# EAGLE schematic Arduino_kuukulgur-alternatiivne2 (EAGLE 6.3)

## Sheet 1 of 8
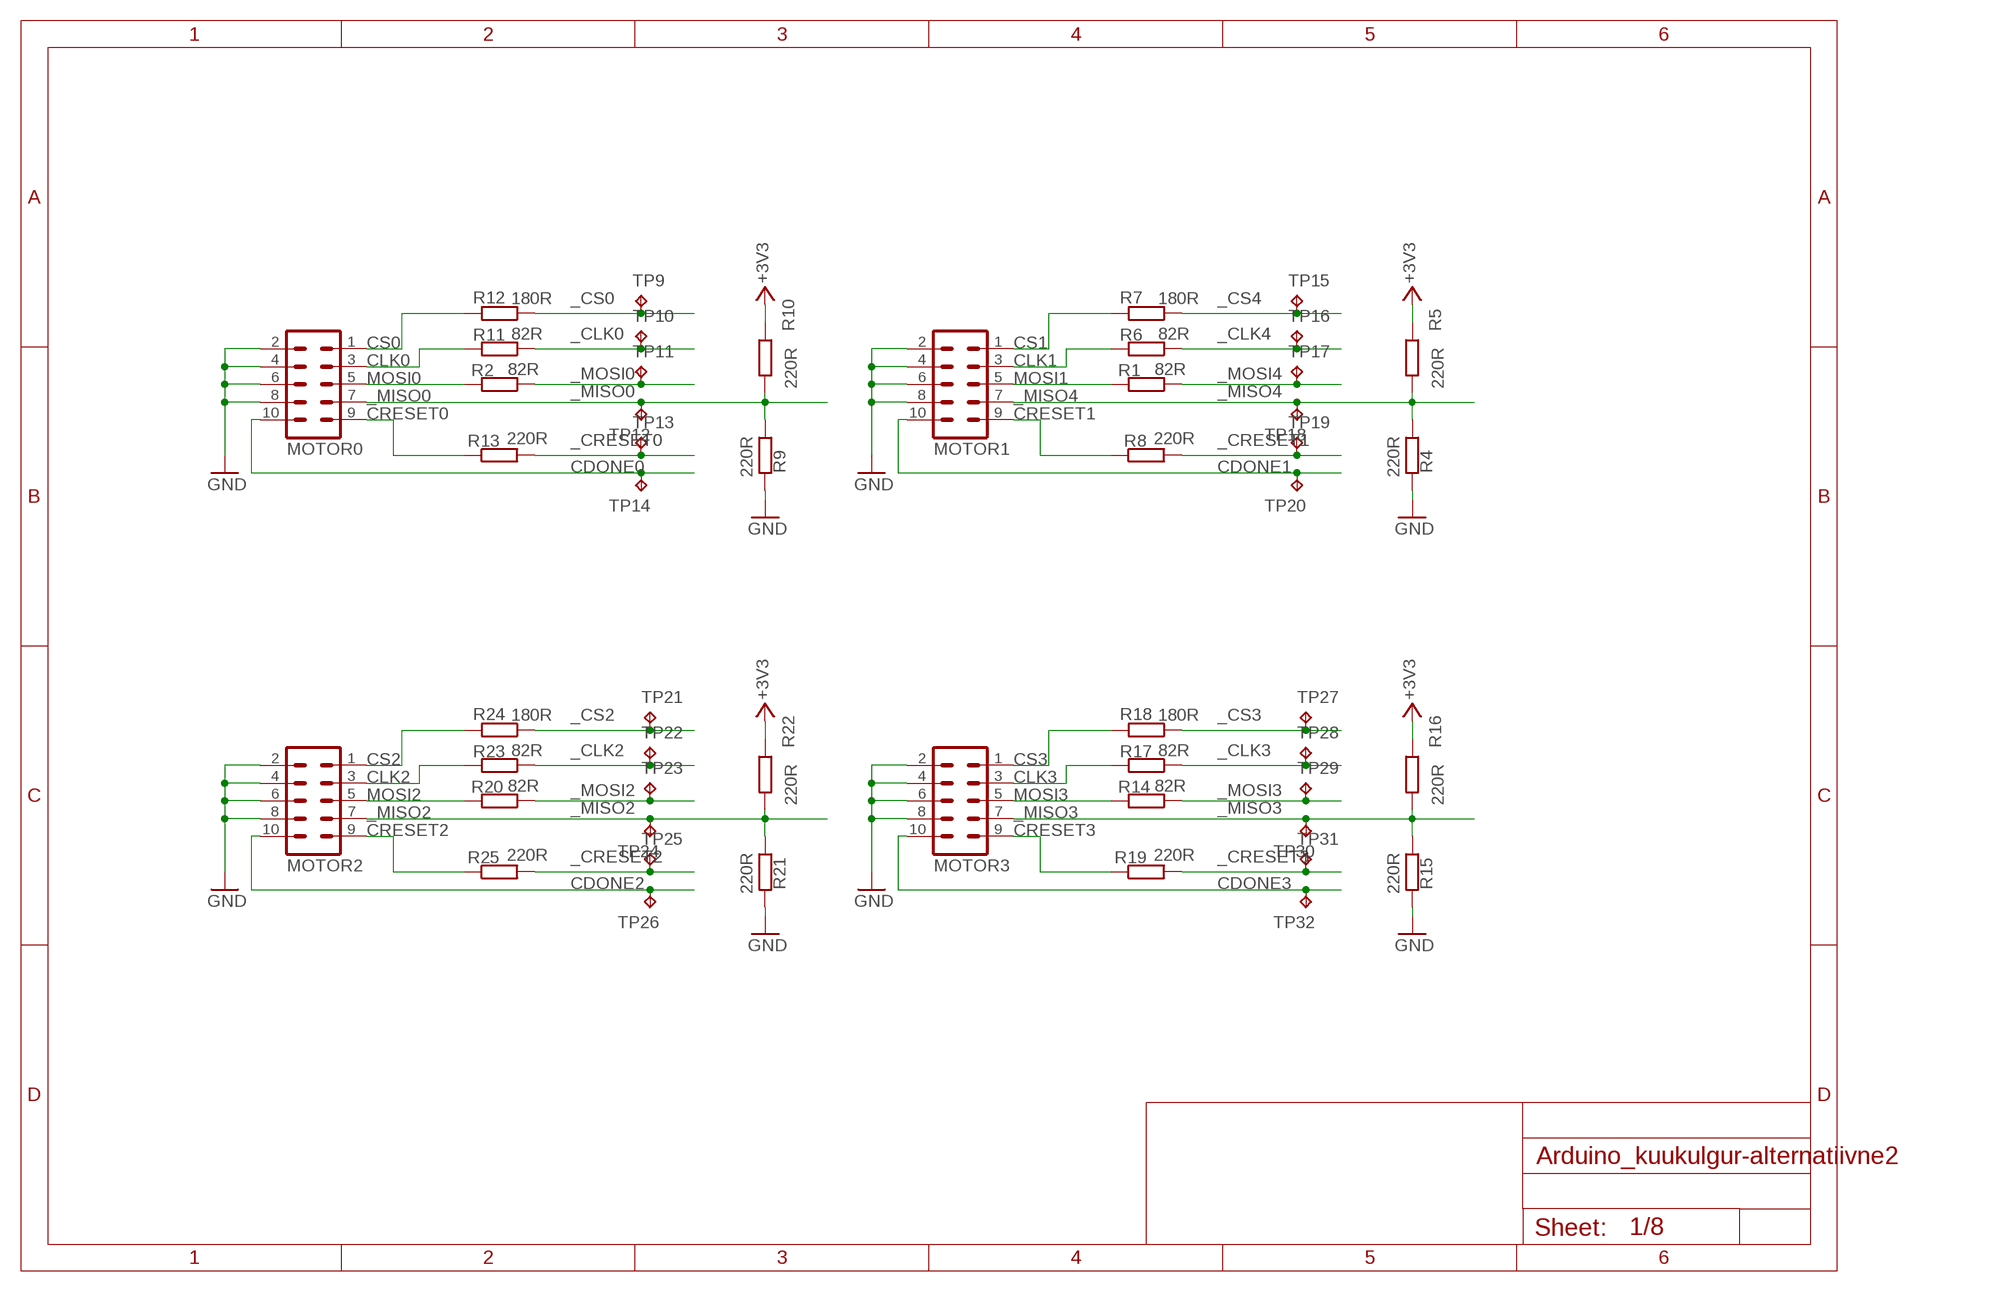
[diagram p0: schematic, sheet 1]

### Parts
MOTOR0  MA05-2  [MA05-2]
MOTOR1  MA05-2  [MA05-2]
MOTOR2  MA05-2  [MA05-2]
MOTOR3  MA05-2  [MA05-2]
R1  82R  R-EU_R0603  [R0603-ROUND]
R2  82R  R-EU_R0603  [R0603-ROUND]
R4  220R  R-EU_R0603  [R0603-ROUND]
R5  220R  R-EU_R0603  [R0603-ROUND]
R6  82R  R-EU_R0603  [R0603-ROUND]
R7  180R  R-EU_R0603  [R0603-ROUND]
R8  220R  R-EU_R0603  [R0603-ROUND]
R9  220R  R-EU_R0603  [R0603-ROUND]
R10  220R  R-EU_R0603  [R0603-ROUND]
R11  82R  R-EU_R0603  [R0603-ROUND]
R12  180R  R-EU_R0603  [R0603-ROUND]
R13  220R  R-EU_R0603  [R0603-ROUND]
R14  82R  R-EU_R0603  [R0603-ROUND]
R15  220R  R-EU_R0603  [R0603-ROUND]
R16  220R  R-EU_R0603  [R0603-ROUND]
R17  82R  R-EU_R0603  [R0603-ROUND]
R18  180R  R-EU_R0603  [R0603-ROUND]
R19  220R  R-EU_R0603  [R0603-ROUND]
R20  82R  R-EU_R0603  [R0603-ROUND]
R21  220R  R-EU_R0603  [R0603-ROUND]
R22  220R  R-EU_R0603  [R0603-ROUND]
R23  82R  R-EU_R0603  [R0603-ROUND]
R24  180R  R-EU_R0603  [R0603-ROUND]
R25  220R  R-EU_R0603  [R0603-ROUND]
TP9  TPB1,27  [B1,27]
TP10  TPB1,27  [B1,27]
TP11  TPB1,27  [B1,27]
TP12  TPB1,27  [B1,27]
TP13  TPB1,27  [B1,27]
TP14  TPB1,27  [B1,27]
TP15  TPB1,27  [B1,27]
TP16  TPB1,27  [B1,27]
TP17  TPB1,27  [B1,27]
TP18  TPB1,27  [B1,27]
TP19  TPB1,27  [B1,27]
TP20  TPB1,27  [B1,27]
TP21  TPB1,27  [B1,27]
TP22  TPB1,27  [B1,27]
TP23  TPB1,27  [B1,27]
TP24  TPB1,27  [B1,27]
TP25  TPB1,27  [B1,27]
TP26  TPB1,27  [B1,27]
TP27  TPB1,27  [B1,27]
TP28  TPB1,27  [B1,27]
TP29  TPB1,27  [B1,27]
TP30  TPB1,27  [B1,27]
TP31  TPB1,27  [B1,27]
TP32  TPB1,27  [B1,27]

### Nets
+4V5 [power]: R5.1 R10.1 R16.1 R22.1 ; supply symbol labelled +3V3 ; also sheet 2,3,4,7,8
_CLK0: R11.1 TP10.TP ; also sheet 2
_CLK2: R23.1 TP22.TP ; also sheet 2
_CLK3: R17.1 TP28.TP ; also sheet 2
_CLK4: R6.1 TP16.TP ; also sheet 2
_CRESET0: R13.2 TP13.TP ; also sheet 2
_CRESET1: R8.2 TP19.TP ; also sheet 2
_CRESET2: R25.2 TP25.TP ; also sheet 2
_CRESET3: R19.2 TP31.TP ; also sheet 2
_CS0: R12.1 TP9.TP ; also sheet 2
_CS2: R24.1 TP21.TP ; also sheet 2
_CS3: R18.1 TP27.TP ; also sheet 2,8
_CS4: R7.1 TP15.TP ; also sheet 2
_MISO0: MOTOR0.7 R9.1 R10.2 TP12.TP ; also sheet 2
_MISO2: MOTOR2.7 R21.1 R22.2 TP24.TP ; also sheet 2
_MISO3: MOTOR3.7 R15.1 R16.2 TP30.TP ; also sheet 2
_MISO4: MOTOR1.7 R4.1 R5.2 TP18.TP ; also sheet 2
_MOSI0: R2.1 TP11.TP ; also sheet 2
_MOSI2: R20.1 TP23.TP ; also sheet 2
_MOSI3: R14.1 TP29.TP ; also sheet 2
_MOSI4: R1.1 TP17.TP ; also sheet 2
CDONE0: MOTOR0.10 TP14.TP ; also sheet 2
CDONE1: MOTOR1.10 TP20.TP ; also sheet 2
CDONE2: MOTOR2.10 TP26.TP ; also sheet 2
CDONE3: MOTOR3.10 TP32.TP ; also sheet 2
CLK0: MOTOR0.3 R11.2
CLK1: MOTOR1.3 R6.2
CLK2: MOTOR2.3 R23.2
CLK3: MOTOR3.3 R17.2
CRESET0: MOTOR0.9 R13.1
CRESET1: MOTOR1.9 R8.1
CRESET2: MOTOR2.9 R25.1
CRESET3: MOTOR3.9 R19.1
CS0: MOTOR0.1 R12.2
CS1: MOTOR1.1 R7.2
CS2: MOTOR2.1 R24.2
CS3: MOTOR3.1 R18.2
GND [morepower]: MOTOR0.2 MOTOR0.4 MOTOR0.6 MOTOR0.8 MOTOR1.2 MOTOR1.4 MOTOR1.6 MOTOR1.8 MOTOR2.2 MOTOR2.4 MOTOR2.6 MOTOR2.8 MOTOR3.2 MOTOR3.4 MOTOR3.6 MOTOR3.8 R4.2 R9.2 R15.2 R21.2 ; also sheet 2,3,4,5,6,7,8
MOSI0: MOTOR0.5 R2.2
MOSI1: MOTOR1.5 R1.2
MOSI2: MOTOR2.5 R20.2
MOSI3: MOTOR3.5 R14.2

## Sheet 2 of 8
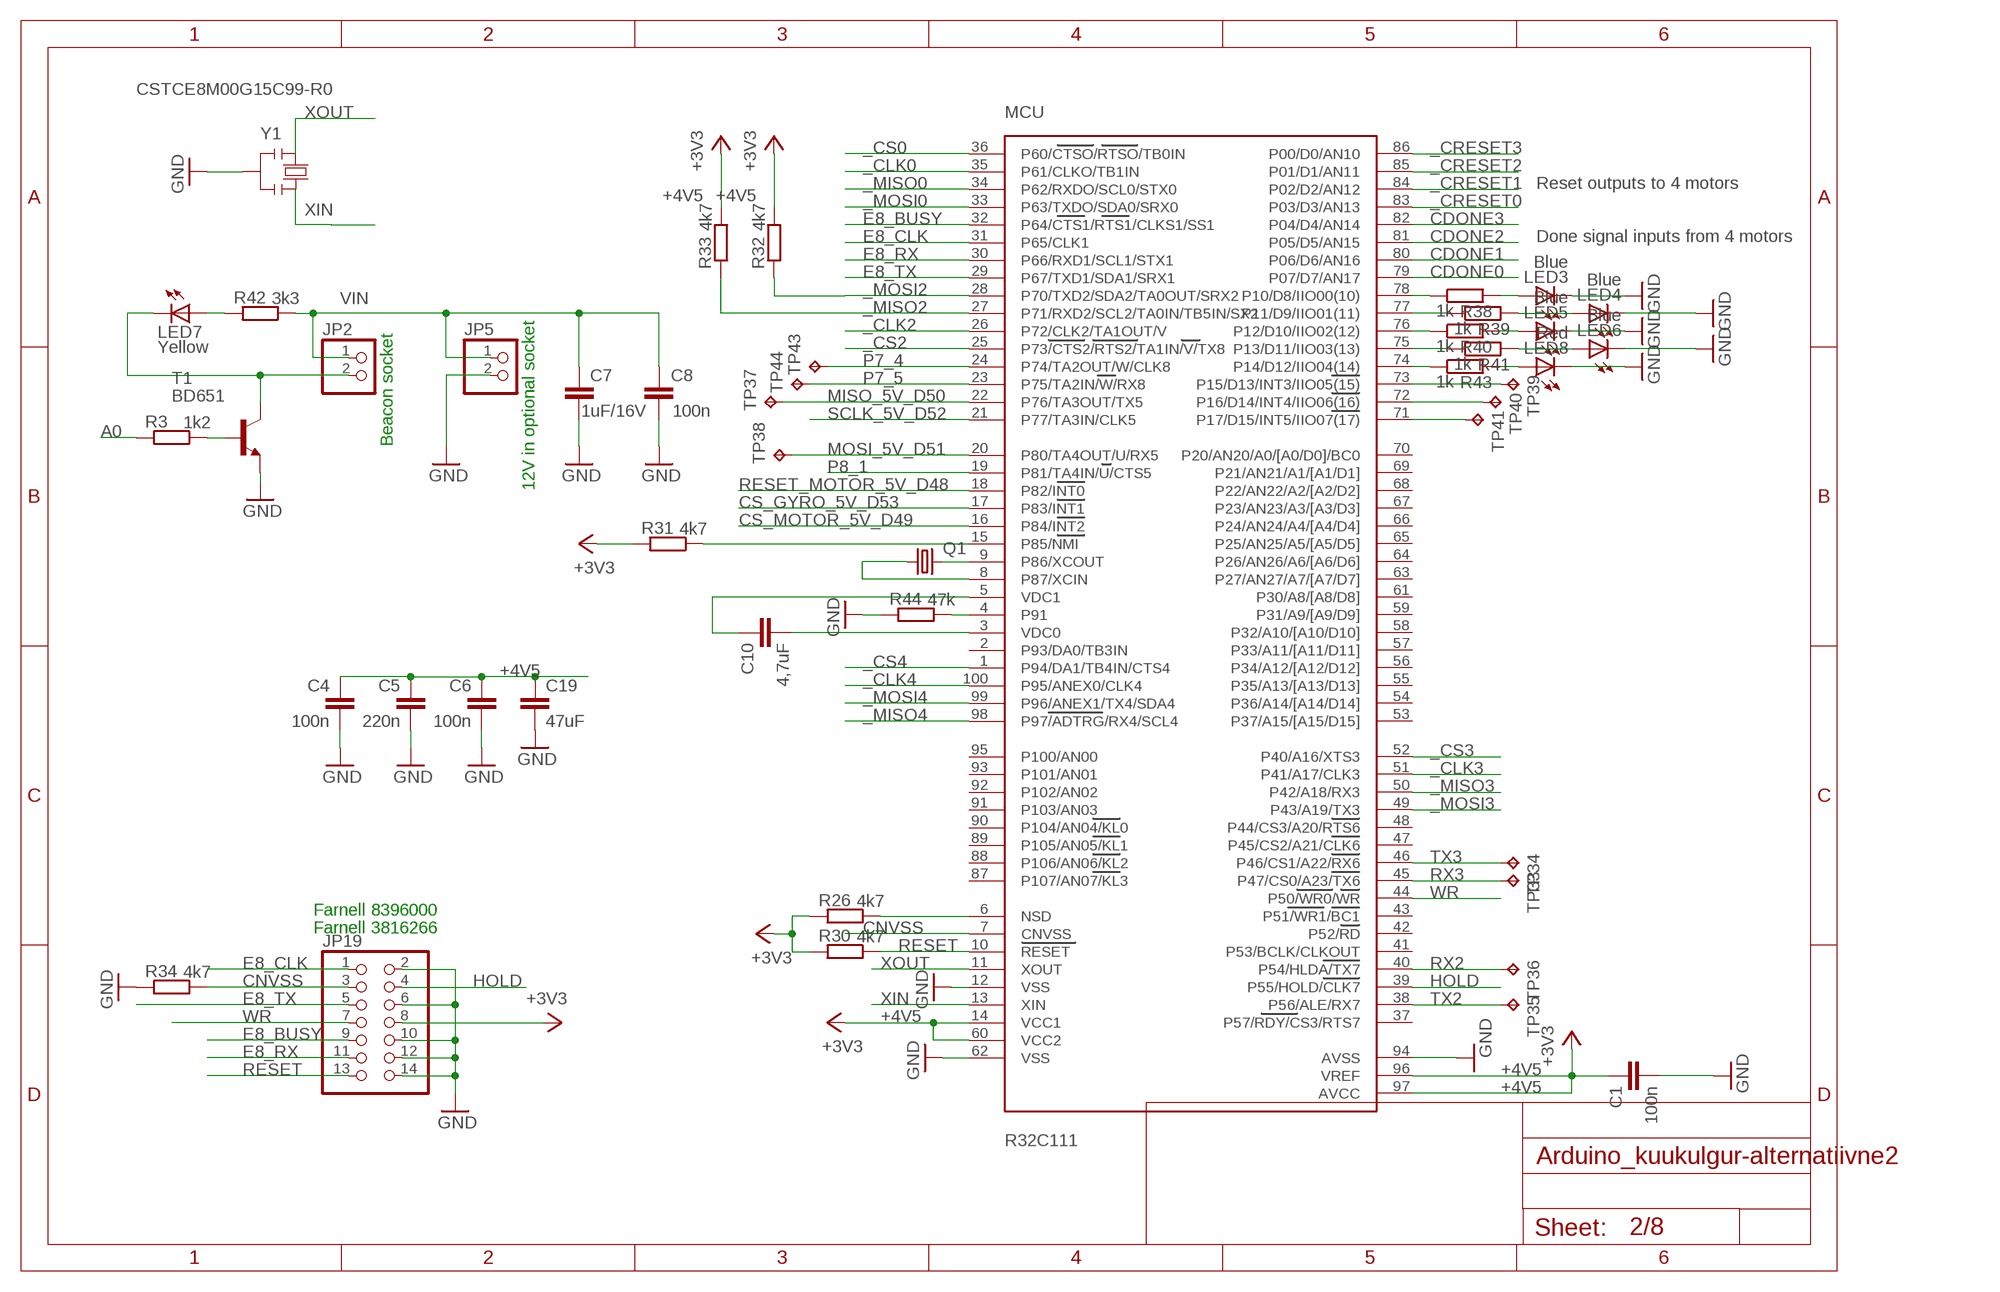
[diagram p1: schematic, sheet 2]

### Parts
C1  100n  C-EU0603-RND  [C0603-ROUND]
C4  100n  C-EU0603-RND  [C0603-ROUND]
C5  220n  C-EU0603-RND  [C0603-ROUND]
C6  100n  C-EU0603-RND  [C0603-ROUND]
C7  1uF/16V  C-EUC0805  [C0805]
C8  100n  C-EU0603-RND  [C0603-ROUND]
C10  4,7uF  C-EU0603-RND  [C0603-ROUND]
C19  47uF  C-EUC0805  [C0805]
JP2  PINHD-1X2  [1X02]
JP5  PINHD-1X2  [1X02]
JP19  PINHD-2X7  [2X07]
LED3  Blue  LEDCHIP-LED0603  [CHIP-LED0603]
LED4  Blue  LEDCHIP-LED0603  [CHIP-LED0603]
LED5  Blue  LEDCHIP-LED0603  [CHIP-LED0603]
LED6  Blue  LEDCHIP-LED0603  [CHIP-LED0603]
LED7  Yellow  LEDCHIP-LED0603  [CHIP-LED0603]
LED8  Red  LEDCHIP-LED0603  [CHIP-LED0603]
MCU  R32C111  [100P6Q-A]
Q1  CRYSTALMM20SS  [MM20SS]
R3  1k2  R-EU_R0603  [R0603-ROUND]
R26  4k7  R-EU_R0603  [R0603-ROUND]
R30  4k7  R-EU_R0603  [R0603-ROUND]
R31  4k7  R-EU_R0603  [R0603-ROUND]
R32  4k7  R-EU_R0603  [R0603-ROUND]
R33  4k7  R-EU_R0603  [R0603-ROUND]
R34  4k7  R-EU_R0603  [R0603-ROUND]
R38  1k  R-EU_R0603  [R0603-ROUND]
R39  1k  R-EU_R0603  [R0603-ROUND]
R40  1k  R-EU_R0603  [R0603-ROUND]
R41  1k  R-EU_R0603  [R0603-ROUND]
R42  3k3  R-EU_R0603  [R0603-ROUND]
R43  1k  R-EU_R0603  [R0603-ROUND]
R44  47k  R-EU_R0603  [R0603-ROUND]
T1  BD651  BD535  [TO220]
TP33  TPB1,27  [B1,27]
TP34  TPB1,27  [B1,27]
TP35  TPB1,27  [B1,27]
TP36  TPB1,27  [B1,27]
TP37  TPB1,27  [B1,27]
TP38  TPB1,27  [B1,27]
TP39  TPB1,27  [B1,27]
TP40  TPB1,27  [B1,27]
TP41  TPB1,27  [B1,27]
TP43  TPB1,27  [B1,27]
TP44  TPB1,27  [B1,27]
Y1  CSTCE8M00G15C99-R0  RESONATORMU  [RESONATOR]

### Nets
+4V5 [power]: C1.1 C4.1 C5.1 C6.1 C19.1 JP19.8 MCU.14(VCC1) MCU.60(VCC2) MCU.96(VREF) MCU.97(AVCC) R26.2 R30.2 R31.2 R32.1 R33.1 ; supply symbol labelled +3V3 ; also sheet 1,3,4,7,8
_CLK0: MCU.35(P61/CLKO/TB1IN) ; also sheet 1
_CLK2: MCU.26(P72/CLK2/TA1OUT/V) ; also sheet 1
_CLK3: MCU.51(P41/A17/CLK3) ; also sheet 1
_CLK4: MCU.100(P95/ANEX0/CLK4) ; also sheet 1
_CRESET0: MCU.83(P03/D3/AN13) ; also sheet 1
_CRESET1: MCU.84(P02/D2/AN12) ; also sheet 1
_CRESET2: MCU.85(P01/D1/AN11) ; also sheet 1
_CRESET3: MCU.86(P00/D0/AN10) ; also sheet 1
_CS0: MCU.36(P60/CTSO/RTSO/TB0IN) ; also sheet 1
_CS2: MCU.25(P73/CTS2/RTS2/TA1IN/V/TX8) ; also sheet 1
_CS3: MCU.52(P40/A16/XTS3) ; also sheet 1,8
_CS4: MCU.1(P94/DA1/TB4IN/CTS4) ; also sheet 1
_MISO0: MCU.34(P62/RXDO/SCL0/STX0) ; also sheet 1
_MISO2: MCU.27(P71/RXD2/SCL2/TA0IN/TB5IN/SX2) R33.2 ; also sheet 1
_MISO3: MCU.50(P42/A18/RX3) ; also sheet 1
_MISO4: MCU.98(P97/ADTRG/RX4/SCL4) ; also sheet 1
_MOSI0: MCU.33(P63/TXDO/SDA0/SRX0) ; also sheet 1
_MOSI2: MCU.28(P70/TXD2/SDA2/TA0OUT/SRX2) R32.2 ; also sheet 1
_MOSI3: MCU.49(P43/A19/TX3) ; also sheet 1
_MOSI4: MCU.99(P96/ANEX1/TX4/SDA4) ; also sheet 1
A0: R3.2 ; also sheet 4
CDONE0: MCU.79(P07/D7/AN17) ; also sheet 1
CDONE1: MCU.80(P06/D6/AN16) ; also sheet 1
CDONE2: MCU.81(P05/D5/AN15) ; also sheet 1
CDONE3: MCU.82(P04/D4/AN14) ; also sheet 1
CNVSS: JP19.3 MCU.7(CNVSS) R34.1
CS_GYRO_5V_D53: MCU.17(P83/INT1) ; also sheet 3,4
CS_MOTOR_5V_D49: MCU.16(P84/INT2) ; also sheet 3,4
E8_BUSY: JP19.9 MCU.32(P64/CTS1/RTS1/CLKS1/SS1) ; also sheet 8
E8_CLK: JP19.1 MCU.31(P65/CLK1)
E8_RX: JP19.11 MCU.30(P66/RXD1/SCL1/STX1) ; also sheet 8
E8_TX: JP19.5 MCU.29(P67/TXD1/SDA1/SRX1) ; also sheet 8
GND [morepower]: C1.2 C4.2 C5.2 C6.2 C7.2 C8.2 C19.2 JP5.2 JP19.2 JP19.6 JP19.10 JP19.12 JP19.14 LED3.C LED4.C LED5.C LED6.C LED8.C MCU.12(VSS) MCU.62(VSS) MCU.94(AVSS) R34.2 R44.2 T1.1(E) Y1.2 ; also sheet 1,3,4,5,6,7,8
HOLD: JP19.4 MCU.39(P55/HOLD/CLK7)
MISO_5V_D50: MCU.22(P76/TA3OUT/TX5) TP37.TP ; also sheet 3,4
MOSI_5V_D51: MCU.20(P80/TA4OUT/U/RX5) TP38.TP ; also sheet 3,4
N$1: C10.1 MCU.5(VDC1)
N$2 [power]: JP2.2 LED7.C T1.2(C)
N$3: MCU.4(P91) R44.1
N$5: C10.2 MCU.3(VDC0)
N$6: R3.1 T1.3(B)
N$7: MCU.9(P86/XCOUT) Q1.4
N$49: MCU.8(P87/XCIN) Q1.1
N$54: MCU.6(NSD) R26.1
N$84: MCU.15(P85/NMI) R31.1
N$85: LED7.A R42.2
N$97: LED3.A R38.2
N$149: LED4.A R39.2
N$150: LED5.A R40.2
N$161: LED6.A R41.2
N$206: LED8.A R43.2
P1_0: MCU.78(P10/D8/IIO00(10)) R38.1
P1_1: MCU.77(P11/D9/IIO01(11)) R39.1
P1_2: MCU.76(P12/D10/IIO02(12)) R40.1
P1_3: MCU.75(P13/D11/IIO03(13)) R41.1
P1_4: MCU.74(P14/D12/IIO04(14)) R43.1
P1_5: MCU.73(P15/D13/INT3/IIO05(15)) TP39.TP
P1_6: MCU.72(P16/D14/INT4/IIO06(16)) TP40.TP
P1_7: MCU.71(P17/D15/INT5/IIO07(17)) TP41.TP
P7_4: MCU.24(P74/TA2OUT/W/CLK8) TP43.TP
P7_5: MCU.23(P75/TA2IN/W/RX8) TP44.TP
P8_1: MCU.19(P81/TA4IN/U/CTS5)
RESET: JP19.13 MCU.10(RESET) R30.1 ; also sheet 4,7
RESET_MOTOR_5V_D48: MCU.18(P82/INT0) ; also sheet 3,4
RX2: MCU.40(P54/HLDA/TX7) TP36.TP ; also sheet 4
RX3: MCU.45(P47/CS0/A23/TX6) TP33.TP ; also sheet 4
SCLK_5V_D52: MCU.21(P77/TA3IN/CLK5) ; also sheet 3,4
TX2: MCU.38(P56/ALE/RX7) TP35.TP ; also sheet 4
TX3: MCU.46(P46/CS1/A22/RX6) TP34.TP ; also sheet 4
VIN [power]: C7.1 C8.1 JP2.1 JP5.1 R42.1 ; also sheet 4,6
WR: JP19.7 MCU.44(P50/WR0/WR)
XIN: MCU.13(XIN) Y1.3
XOUT: MCU.11(XOUT) Y1.1
Unconnected: MCU.2(P93/DA0/TB3IN) MCU.37(P57/RDY/CS3/RTS7) MCU.41(P53/BCLK/CLKOUT) MCU.42(P52/RD) MCU.43(P51/WR1/BC1) MCU.47(P45/CS2/A21/CLK6) MCU.48(P44/CS3/A20/RTS6) MCU.53(P37/A15/[A15/D15]) MCU.54(P36/A14/[A14/D14]) MCU.55(P35/A13/[A13/D13]) MCU.56(P34/A12/[A12/D12]) MCU.57(P33/A11/[A11/D11]) MCU.58(P32/A10/[A10/D10]) MCU.59(P31/A9/[A9/D9]) MCU.61(P30/A8/[A8/D8]) MCU.63(P27/AN27/A7/[A7/D7]) MCU.64(P26/AN26/A6/[A6/D6]) MCU.65(P25/AN25/A5/[A5/D5]) MCU.66(P24/AN24/A4/[A4/D4]) MCU.67(P23/AN23/A3/[A3/D3]) MCU.68(P22/AN22/A2/[A2/D2]) MCU.69(P21/AN21/A1/[A1/D1]) MCU.70(P20/AN20/A0/[A0/D0]/BC0) MCU.87(P107/AN07/KL3) MCU.88(P106/AN06/KL2) MCU.89(P105/AN05/KL1) MCU.90(P104/AN04/KL0) MCU.91(P103/AN03) MCU.92(P102/AN02) MCU.93(P101/AN01) MCU.95(P100/AN00)

### Notes on the sheet
- Reset outputs to 4 motors
- Done signal inputs from 4 motors
- Beacon socket
- 12V in optional socket
- Farnell 8396000
- Farnell 3816266

## Sheet 3 of 8
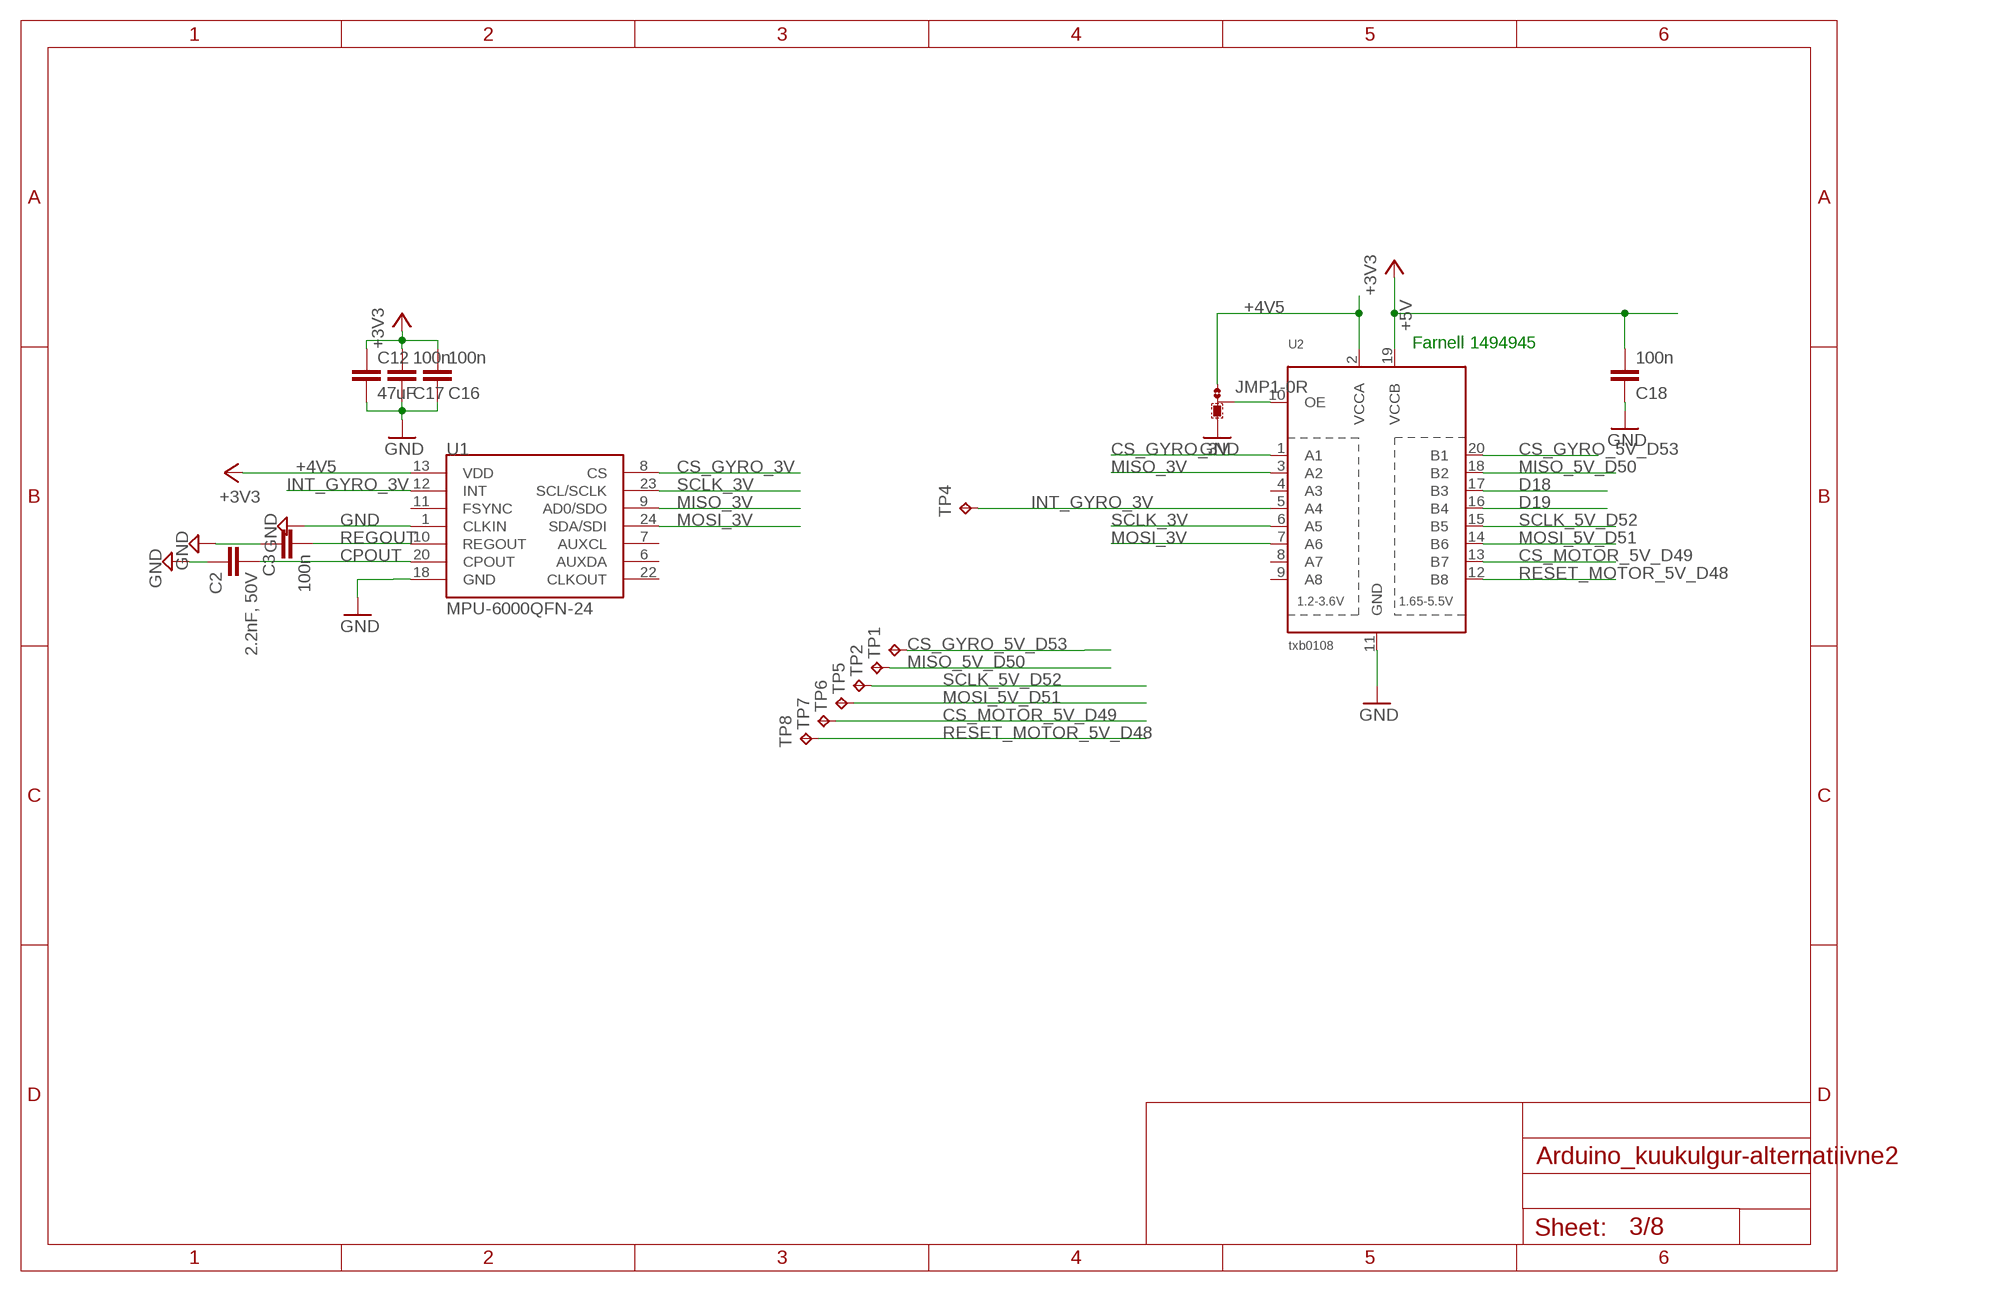
[diagram p2: schematic, sheet 3]

### Parts
C2  2.2nF, 50V  C-EU0603-RND  [C0603-ROUND]
C3  100n  C-EU0603-RND  [C0603-ROUND]
C12  47uF  C-EUC0805  [C0805]
C16  100n  C-EU0603-RND  [C0603-ROUND]
C17  100n  C-EU0603-RND  [C0603-ROUND]
C18  100n  C-EU0603-RND  [C0603-ROUND]
JMP1  0R-JUMPB  [B0R-JMP]
TP1  TPB1,27  [B1,27]
TP2  TPB1,27  [B1,27]
TP4  TPB1,27  [B1,27]
TP5  TPB1,27  [B1,27]
TP6  TPB1,27  [B1,27]
TP7  TPB1,27  [B1,27]
TP8  TPB1,27  [B1,27]
U1  MPU-6000QFN-24  [QFN-24-TESTING]
U2  txb0108  TXB0108PWR  [TSSOP20]

### Nets
+4V5 [power]: C12.1 C16.2 C17.2 JMP1.1 U1.13(VDD) U2.2(VCCA) ; supply symbol labelled +3V3 ; also sheet 1,2,4,7,8
+5V [power]: C18.2 U2.19(VCCB) ; supply symbol labelled +3V3 ; also sheet 4,5,6,7
CPOUT: C2.2 U1.20(CPOUT)
CS_GYRO_3V: U1.8(CS) U2.1(A1)
CS_GYRO_5V_D53: TP1.TP U2.20(B1) ; also sheet 2,4
CS_MOTOR_5V_D49: TP7.TP U2.13(B7) ; also sheet 2,4
D18: U2.17(B3) ; also sheet 4
D19: U2.16(B4) ; also sheet 4
GND [morepower]: C2.1 C3.1 C12.2 C16.1 C17.1 C18.1 JMP1.3 U1.1(CLKIN) U1.18(GND) U2.11(GND) ; also sheet 1,2,4,5,6,7,8
INT_GYRO_3V: TP4.TP U1.12(INT) U2.5(A4)
MISO_3V: U1.9(AD0/SDO) U2.3(A2)
MISO_5V_D50: TP2.TP U2.18(B2) ; also sheet 2,4
MOSI_3V: U1.24(SDA/SDI) U2.7(A6)
MOSI_5V_D51: TP6.TP U2.14(B6) ; also sheet 2,4
N$73 [power]: JMP1.2 U2.10(OE)
REGOUT: C3.2 U1.10(REGOUT)
RESET_MOTOR_5V_D48: TP8.TP U2.12(B8) ; also sheet 2,4
SCLK_3V: U1.23(SCL/SCLK) U2.6(A5)
SCLK_5V_D52: TP5.TP U2.15(B5) ; also sheet 2,4
Unconnected: U1.6(AUXDA) U1.7(AUXCL) U1.11(FSYNC) U1.22(CLKOUT) U2.4(A3) U2.8(A7) U2.9(A8)

### Notes on the sheet
- Farnell 1494945

## Sheet 4 of 8
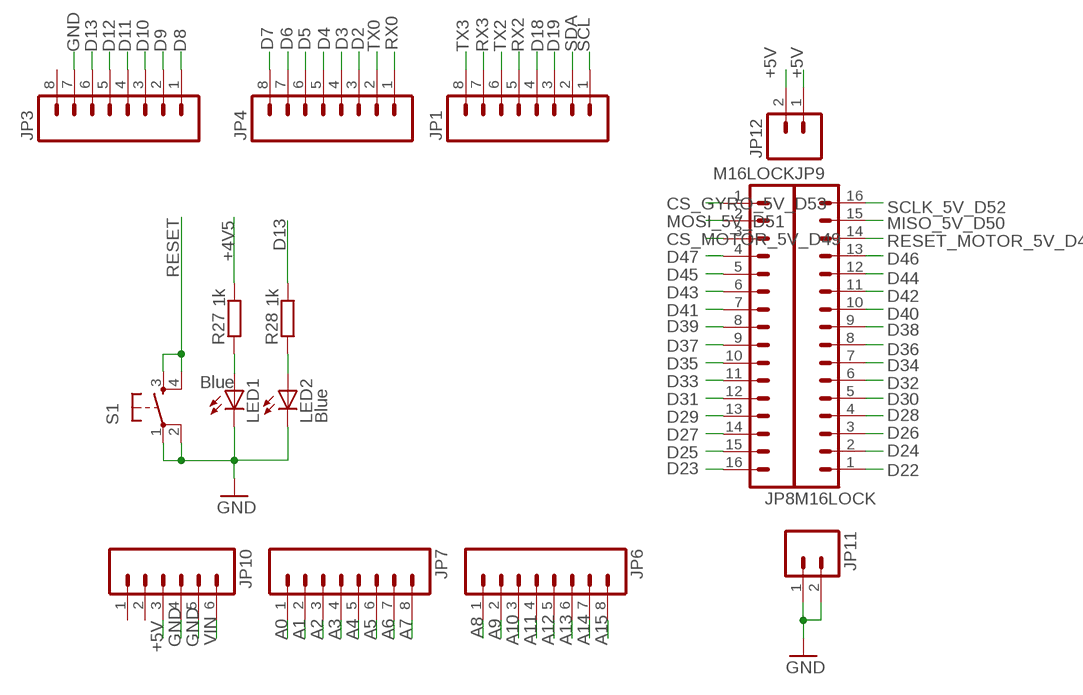
[diagram p3: schematic, sheet 4]

### Parts
JP1  M08LOCK  [1X08_LOCK]
JP3  M08LOCK  [1X08_LOCK]
JP4  M08LOCK  [1X08_LOCK]
JP6  M08LOCK  [1X08_LOCK]
JP7  M08LOCK  [1X08_LOCK]
JP8  M16LOCK  [1X16_LOCK]
JP9  M16LOCK  [1X16_LOCK]
JP10  M06LOCK  [1X06_LOCK]
JP11  M02LOCK  [1X02_LOCK]
JP12  M02LOCK  [1X02_LOCK]
LED1  Blue  LEDCHIP-LED0603  [CHIP-LED0603]
LED2  Blue  LEDCHIP-LED0603  [CHIP-LED0603]
R27  1k  R-EU_R0603  [R0603-ROUND]
R28  1k  R-EU_R0603  [R0603-ROUND]
S1  TAC_SWITCHPTH  [TACTILE-PTH]

### Nets
+4V5 [power]: R27.1 ; also sheet 1,2,3,7,8
+5V [power]: JP10.3 JP12.1 JP12.2 ; also sheet 3,5,6,7
A0: JP7.1 ; also sheet 2
A1: JP7.2
A2: JP7.3 ; also sheet 5
A3: JP7.4 ; also sheet 5
A4: JP7.5 ; also sheet 5
A5: JP7.6 ; also sheet 5
A6: JP7.7 ; also sheet 5
A7: JP7.8 ; also sheet 5
A8: JP6.1
A9: JP6.2
A10: JP6.3
A11: JP6.4
A12: JP6.5
A13: JP6.6
A14: JP6.7
A15: JP6.8
CS_GYRO_5V_D53: JP8.1 ; also sheet 2,3
CS_MOTOR_5V_D49: JP8.3 ; also sheet 2,3
D2: JP4.3 ; also sheet 5
D3: JP4.4 ; also sheet 5
D4: JP4.5 ; also sheet 5
D5: JP4.6 ; also sheet 5
D6: JP4.7 ; also sheet 5
D7: JP4.8 ; also sheet 5
D8: JP3.1 ; also sheet 5
D9: JP3.2 ; also sheet 5
D10: JP3.3 ; also sheet 5
D11: JP3.4 ; also sheet 5
D12: JP3.5 ; also sheet 5
D13: JP3.6 R28.1
D18: JP1.4 ; also sheet 3
D19: JP1.3 ; also sheet 3
D22: JP9.1
D23: JP8.16
D24: JP9.2
D25: JP8.15
D26: JP9.3
D27: JP8.14
D28: JP9.4
D29: JP8.13
D30: JP9.5
D31: JP8.12
D32: JP9.6
D33: JP8.11
D34: JP9.7
D35: JP8.10
D36: JP9.8
D37: JP8.9
D38: JP9.9
D39: JP8.8
D40: JP9.10
D41: JP8.7
D42: JP9.11
D43: JP8.6 ; also sheet 5
D44: JP9.12 ; also sheet 5
D45: JP8.5 ; also sheet 5
D46: JP9.13 ; also sheet 5
D47: JP8.4 ; also sheet 5
GND [morepower]: JP3.7 JP10.4 JP10.5 JP11.1 JP11.2 LED1.C LED2.C S1.1 S1.2 ; also sheet 1,2,3,5,6,7,8
MISO_5V_D50: JP9.15 ; also sheet 2,3
MOSI_5V_D51: JP8.2 ; also sheet 2,3
N$126: LED1.A R27.2
N$127: LED2.A R28.2
RESET: S1.3 S1.4 ; also sheet 2,7
RESET_MOTOR_5V_D48: JP9.14 ; also sheet 2,3
RX0: JP4.1
RX2: JP1.5 ; also sheet 2
RX3: JP1.7 ; also sheet 2
SCL: JP1.1
SCLK_5V_D52: JP9.16 ; also sheet 2,3
SDA: JP1.2
TX0: JP4.2
TX2: JP1.6 ; also sheet 2
TX3: JP1.8 ; also sheet 2
VIN [power]: JP10.6 ; also sheet 2,6
Unconnected: JP3.8 JP10.1 JP10.2

## Sheet 5 of 8
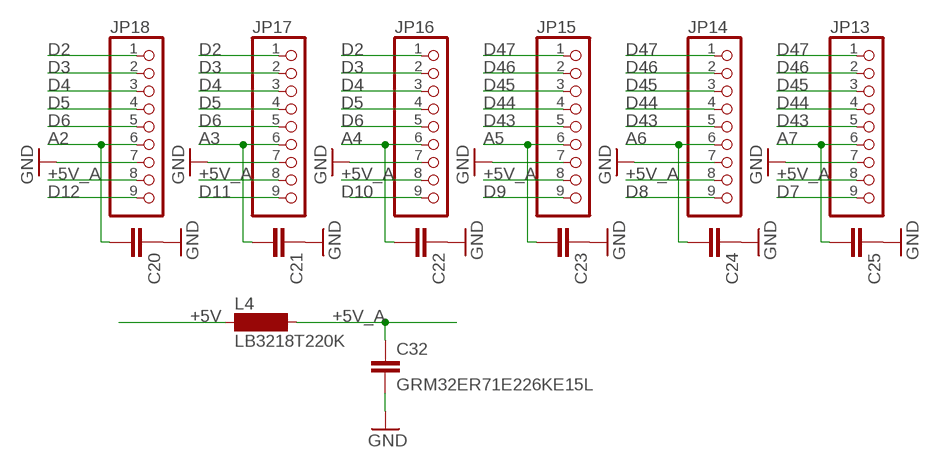
[diagram p4: schematic, sheet 5]

### Parts
C20  C-EUC0603  [C0603]
C21  C-EUC0603  [C0603]
C22  C-EUC0603  [C0603]
C23  C-EUC0603  [C0603]
C24  C-EUC0603  [C0603]
C25  C-EUC0603  [C0603]
C32  GRM32ER71E226KE15L  C-EUC1210  [C1210]
JP13  PINHD-1X9  [1X09]
JP14  PINHD-1X9  [1X09]
JP15  PINHD-1X9  [1X09]
JP16  PINHD-1X9  [1X09]
JP17  PINHD-1X9  [1X09]
JP18  PINHD-1X9  [1X09]
L4  LB3218T220K  SM-1206  [SM-1206]

### Nets
+5V [power]: L4.1 ; also sheet 3,4,6,7
+5V_A [morepower]: C32.1 JP13.8 JP14.8 JP15.8 JP16.8 JP17.8 JP18.8 L4.2
A2: C20.2 JP18.6 ; also sheet 4
A3: C21.2 JP17.6 ; also sheet 4
A4: C22.2 JP16.6 ; also sheet 4
A5: C23.2 JP15.6 ; also sheet 4
A6: C24.2 JP14.6 ; also sheet 4
A7: C25.2 JP13.6 ; also sheet 4
D2: JP16.1 JP17.1 JP18.1 ; also sheet 4
D3: JP16.2 JP17.2 JP18.2 ; also sheet 4
D4: JP16.3 JP17.3 JP18.3 ; also sheet 4
D5: JP16.4 JP17.4 JP18.4 ; also sheet 4
D6: JP16.5 JP17.5 JP18.5 ; also sheet 4
D7: JP13.9 ; also sheet 4
D8: JP14.9 ; also sheet 4
D9: JP15.9 ; also sheet 4
D10: JP16.9 ; also sheet 4
D11: JP17.9 ; also sheet 4
D12: JP18.9 ; also sheet 4
D43: JP13.5 JP14.5 JP15.5 ; also sheet 4
D44: JP13.4 JP14.4 JP15.4 ; also sheet 4
D45: JP13.3 JP14.3 JP15.3 ; also sheet 4
D46: JP13.2 JP14.2 JP15.2 ; also sheet 4
D47: JP13.1 JP14.1 JP15.1 ; also sheet 4
GND [morepower]: C20.1 C21.1 C22.1 C23.1 C24.1 C25.1 C32.2 JP13.7 JP14.7 JP15.7 JP16.7 JP17.7 JP18.7 ; also sheet 1,2,3,4,6,7,8

## Sheet 6 of 8
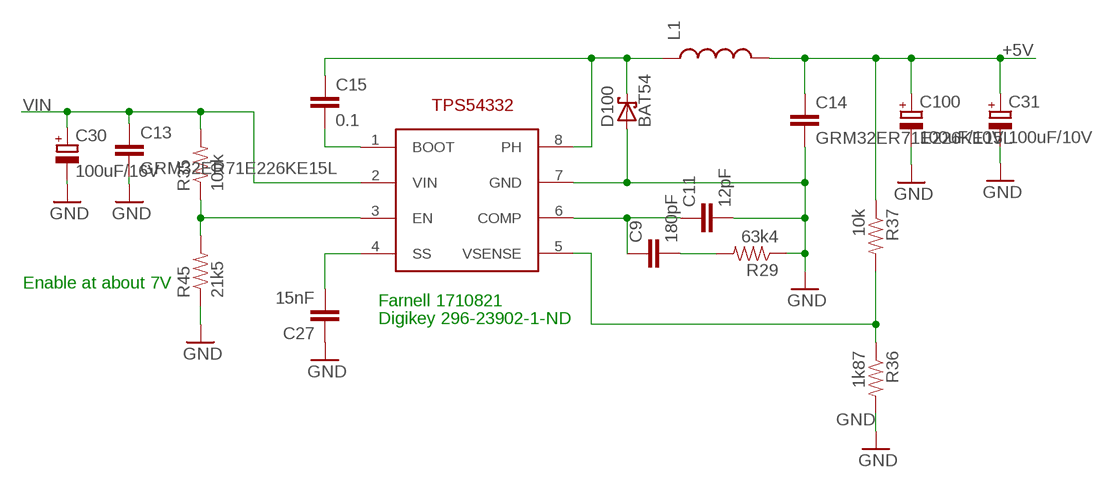
[diagram p5: schematic, sheet 6]

### Parts
C9  180pF  CAP0603-CAP  [0603-CAP]
C11  12pF  CAP0603-CAP  [0603-CAP]
C13  GRM32ER71E226KE15L  C-EUC1210  [C1210]
C14  GRM32ER71E226KE15L  C-EUC1210  [C1210]
C15  0.1  CAP0603-CAP  [0603-CAP]
C27  15nF  CAP0603-CAP  [0603-CAP]
C30  100uF/16V  CPOL-EUC/6032-28R  [C/6032-28R]
C31  100uF/10V  CPOL-EUC/6032-28R  [C/6032-28R]
C100  100uF/10V  CPOL-EUC/6032-28R  [C/6032-28R]
D100  BAT54  [SOT23]
L1  INDUCTORSRU1038  [SRU1038]
R29  63k4  RESISTOR0603-RES  [0603-RES]
R35  100k  RESISTOR0603-RES  [0603-RES]
R36  1k87  RESISTOR0603-RES  [0603-RES]
R37  10k  RESISTOR0603-RES  [0603-RES]
R45  21k5  RESISTOR0603-RES  [0603-RES]
U$3  TPS54332  [SO8]

### Nets
+5V [power]: C14.1 C31.+ C100.+ L1.2 R37.1 ; also sheet 3,4,5,7
ENABLE_PANDA: R35.1 R45.2 U$3.3(EN)
GND [morepower]: C11.2 C13.2 C14.2 C27.1 C30.- C31.- C100.- D100.1(A) R29.1 R36.2 R45.1 U$3.7(GND) ; also sheet 1,2,3,4,5,7,8
N$96: C27.2 U$3.4(SS)
N$109: C9.1 C11.1 U$3.6(COMP)
N$120: C9.2 R29.2
N$121: C15.2 U$3.1(BOOT)
N$125: R36.1 R37.2 U$3.5(VSENSE)
N$138 [morepower]: C15.1 D100.3(C) L1.1 U$3.8(PH)
VIN [power]: C13.1 C30.+ R35.2 U$3.2(VIN) ; also sheet 2,4

### Notes on the sheet
- Enable at about 7V
- Farnell 1710821
- Digikey 296-23902-1-ND

## Sheet 7 of 8
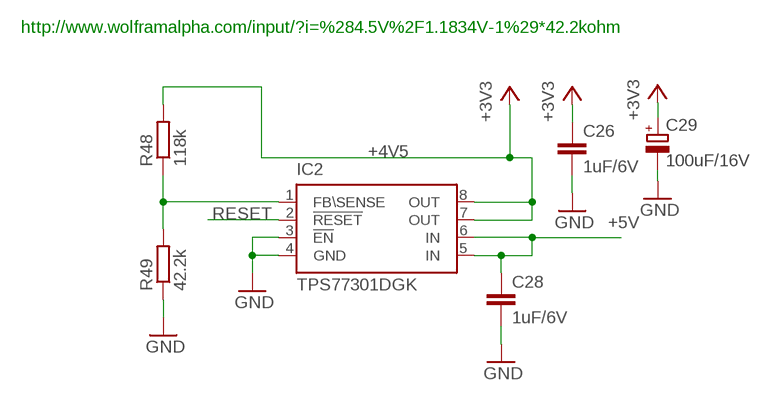
[diagram p6: schematic, sheet 7]

### Parts
C26  1uF/6V  C-EUC0603  [C0603]
C28  1uF/6V  C-EUC0603  [C0603]
C29  100uF/16V  CPOL-EUC/6032-28R  [C/6032-28R]
IC2  TPS77301DGK  TPS773  [MSOP8]
R48  118k  R-EU_R0603  [R0603]
R49  42.2k  R-EU_R0603  [R0603]

### Nets
+4V5 [power]: C26.1 C29.+ IC2.7(OUT) IC2.8(OUT) R48.2 ; supply symbol labelled +3V3 ; also sheet 1,2,3,4,8
+5V [power]: C28.1 IC2.5(IN) IC2.6(IN) ; also sheet 3,4,5,6
GND [morepower]: C26.2 C28.2 C29.- IC2.3(!EN) IC2.4(GND) R49.1 ; also sheet 1,2,3,4,5,6,8
N$55: IC2.1(FB\SENSE) R48.1 R49.2
RESET: IC2.2(!RESET) ; also sheet 2,4

### Notes on the sheet
- http://www.wolframalpha.com/input/?i=%284.5V%2F1.1834V-1%29*42.2kohm

## Sheet 8 of 8
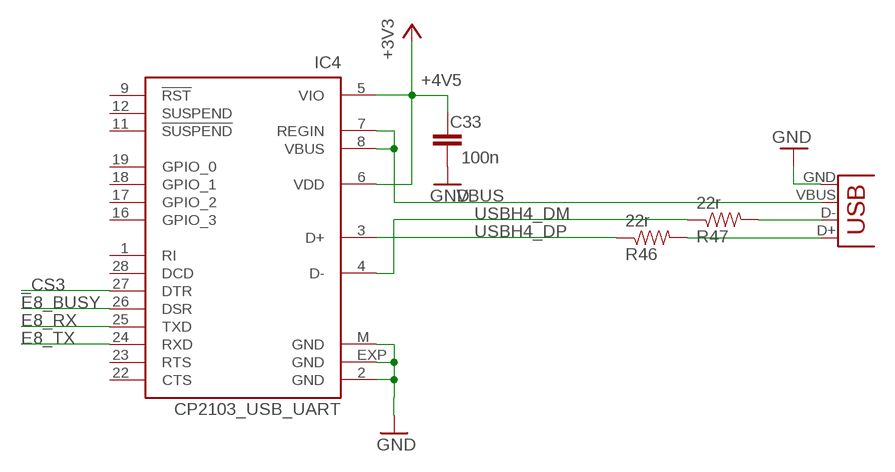
[diagram p7: schematic, sheet 8]

### Parts
C33  100n  C-EU0603-RND  [C0603-ROUND]
IC4  CP2103_USB_UART  [MLP28]
R46  22r  RESISTOR  [0805]
R47  22r  RESISTOR  [0805]
X2  USBSMD  [USB-MINIB]

### Nets
+4V5 [power]: C33.1 IC4.5(VIO) IC4.6(VDD) ; supply symbol labelled +3V3 ; also sheet 1,2,3,4,7
_CS3: IC4.27(DTR) ; also sheet 1,2
D+: R46.2 X2.D+
D-: R47.2 X2.D-
E8_BUSY: IC4.26(DSR) ; also sheet 2
E8_RX: IC4.25(TXD) ; also sheet 2
E8_TX: IC4.24(RXD) ; also sheet 2
GND [morepower]: C33.2 IC4.2(GND) IC4.EXP(GND) IC4.M(GND) X2.GND ; also sheet 1,2,3,4,5,6,7
USBH4_DM: IC4.4(D-) R47.1
USBH4_DP: IC4.3(D+) R46.1
VBUS [power]: IC4.7(REGIN) IC4.8(VBUS) X2.VBUS
Unconnected: IC4.1(RI) IC4.9(!RST) IC4.11(!SUSPEND) IC4.12(SUSPEND) IC4.16(GPIO_3) IC4.17(GPIO_2) IC4.18(GPIO_1) IC4.19(GPIO_0) IC4.22(CTS) IC4.23(RTS) IC4.28(DCD)

## Library data of the parts
C1-C6 C8 C10 C16-C18 C33 = SmartPrj:C-EU: CAPACITOR, European symbol
C7 C13 C14 C20-C25 C32 = rcl:C-EU: CAPACITOR, European symbol
C9 C11 C15 C27 = SparkFun:CAP: Capacitor Standard 0603 ceramic capacitor, and 0.1" leaded capacitor.
C12 C19 C26 C28 = resistor:C-EU: CAPACITOR, European symbol
C29-C31 C100 = rcl:CPOL-EU: POLARIZED CAPACITOR, European symbol
D100 = diode:BAT54: Schottky Diodes Source: Fairchild .. BAT54.pdf
IC2 = samuel:TPS773*: 250-mA LDO REGULATORS WITH RESET OUTPUT WITH 8-PIN MSOP PACKAGING Source: http://focus.ti.com/lit/ds/symlink/tps77333.pdf
IC4 = SparkFun:CP2103_USB_UART: Single-Chip USB to UART Bridge Source: www.silabs.com .. CP2103.pdf. Spark Fun Electronics SKU : COM-00309
JMP1 = jump-0r-smd:0R-JUMP: SMD 0R 0805 Jumper
JP1 JP3 JP4 JP6 JP7 = SparkFun:M08: Header 8 Standard 8-pin 0.1" header. Use with straight break away headers (SKU : PRT-00116), right angle break away headers (PRT-00553), swiss pins (PRT-00743), machine pins (PRT-00117), and female headers (PRT-00115).
JP2 JP5 = pinhead:PINHD-1X2: PIN HEADER
JP8 JP9 = SparkFun:M16
JP10 = SparkFun:M06: Header 6 Standard 6-pin 0.1" header. Use with straight break away headers (SKU : PRT-00116), right angle break away headers (PRT-00553), swiss pins (PRT-00743), machine pins (PRT-00117), and female headers (PRT-00115). Molex polarized connector foot print use with SKU : PRT-08094 with associated crimp pins and housings. NOTES ON THE VARIANTS LOCK and LOCK_LONGPADS... This footprint was designed to help hold the alignment of a through-hole component (i.e. 6-pin header) while soldering it into place. You may notice that each hole has been shifted either up or down by 0.005 of an inch from it's more standard position (which is a perfectly straight line). This slight alteration caused the pins (the squares in the middle) to touch the edges of the holes. Because they are alternating, it causes a "brace" to hold the component in place. 0.005 has proven to be the perfect amount of "off-center" position when using our standard breakaway headers. Although looks a little odd when you look at the bare footprint, once you have a header in there, the alteration is very hard to notice. Also, if you push a header all the way into place, it is covered up entirely on the bottom side. This idea of altering the position of holes to aid alignment will be further integrated into the Sparkfun Library for other footprints. It can help hold any component with 3 or more connection pins.
JP11 JP12 = SparkFun:M02: Header 2 Standard 2-pin 0.1" header. Use with straight break away headers (SKU : PRT-00116), right angle break away headers (PRT-00553), swiss pins (PRT-00743), machine pins (PRT-00117), and female headers (PRT-00115). Molex polarized connector foot print use with SKU : PRT-08233 with associated crimp pins and housings.
JP13-JP18 = pinhead:PINHD-1X9: PIN HEADER
JP19 = pinhead:PINHD-2X7: PIN HEADER
L1 = SparkFun:INDUCTOR: Inductors Basic Inductor/Choke - 0603 and 1206. Footprints are not proven and vary greatly between part numbers.
L4 = inductor-neosid:SM-1206: INDUCTOR SMD chip inductor; OC_FARNELL: unknown; OC_NEWARK: unknown
LED1-LED8 = led:LED: LED OSRAM: - CHIPLED LG R971, LG N971, LY N971, LG Q971, LY Q971, LO R971, LY R971 LH N974, LH R974 LS Q976, LO Q976, LY Q976 LO Q996 - Hyper CHIPLED LW Q18S LB Q993, LB Q99A, LB R99A - SideLED LS A670, LO A670, LY A670, LG A670, LP A670 LB A673, LV A673, LT A673, LW A673 LH A674 LY A675 LS A676, LA A676, LO A676, LY A676, LW A676 LS A679, LY A679, LG A679 - Hyper Micro SIDELED® LS Y876, LA Y876, LO Y876, LY Y876 LT Y87S - SmartLED LW L88C, LW L88S LB L89C, LB L89S, LG L890 LS L89K, LO L89K, LY L89K LS L896, LA L896, LO L896, LY L896 - TOPLED LS T670, LO T670, LY T670, LG T670, LP T670 LSG T670, LSP T670, LSY T670, LOP T670, LYG T670 LG T671, LOG T671, LSG T671 LB T673, LV T673, LT T673, LW T673 LH T674 LS T676, LA T676, LO T676, LY T676, LB T676, LH T676, LSB T676, LW T676 LB T67C, LV T67C, LT T67C, LS T67K, LO T67K, LY T67K, LW E67C LS E67B, LA E67B, LO E67B, LY E67B, LB E67C, LV E67C, LT E67C LW T67C LS T679, LY T679, LG T679 LS T770, LO T770, LY T770, LG T770, LP T770 LB T773, LV T773, LT T773, LW T773 LH T774 LS E675, LA E675, LY E675, LS T675 LS T776, LA T776, LO T776, LY T776, LB T776 LHGB T686 LT T68C, LB T68C - Hyper Mini TOPLED® LB M676 - Mini TOPLED Santana® LG M470 LS M47K, LO M47K, LY M47K Source: http://www.osram.convergy.de LUXEON: - LUMILED® LXK2-PW12-R00, LXK2-PW12-S00, LXK2-PW14-U00, LXK2-PW14-V00 LXK2-PM12-R00, LXK2-PM12-S00, LXK2-PM14-U00 LXK2-PE12-Q00, LXK2-PE12-R00, LXK2-PE12-S00, LXK2-PE14-T00, LXK2-PE14-U00 LXK2-PB12-K00, LXK2-PB12-L00, LXK2-PB12-M00, LXK2-PB14-N00, LXK2-PB14-P00, LXK2-PB14-Q00 LXK2-PR12-L00, LXK2-PR12-M00, LXK2-PR14-Q00, LXK2-PR14-R00 LXK2-PD12-Q00, LXK2-PD12-R00, LXK2-PD12-S00 LXK2-PH12-R00, LXK2-PH12-S00 LXK2-PL12-P00, LXK2-PL12-Q00, LXK2-PL12-R00 Source: www.luxeon.com KINGBRIGHT: KA-3528ASYC Source: www.kingbright.com
MCU = renesas_mcu:R32C111
MOTOR0 MOTOR1-MOTOR3 = con-lstb:MA05-2: PIN HEADER; OC_FARNELL: unknown; OC_NEWARK: unknown
Q1 = crystal:CRYSTAL: CRYSTAL; OC_FARNELL: unknown; OC_NEWARK: unknown
R1-R28 R30-R34 R38-R44 = SmartPrj:R-EU_: RESISTOR, European symbol
R29 R35-R37 R45-R47 = SparkFun:RESISTOR: Resistor Basic schematic elements and footprints for 0603, 1206, and PTH 1/10th watt (small) resistors.
R48 R49 = rcl:R-EU_: RESISTOR, European symbol
S1 = SparkFun:TAC_SWITCH: Momentary Switch Button commonly used for reset or general input. Spark Fun Electronics SKU : COM-00097
T1 = transistor:BD535: NPN TRANSISTOR
TP1 TP2 TP4-TP41 TP43 TP44 = testpad:TP: Test pad
U1 = SparkFun-Sensors:MPU-6000: MPU-6000 - I2C address is 0x68 with AD0 low and 0x69 with AD0 high.
U2 = adafruit:TXB0108PWR: 8-Bit Bi-Directional Level Shifter 1.2V-3.6V (VCCA) to 1.65V-5.5V (VCCB) bi-directional level shifter with auto direction sensing. Max data rate - VCCA 1.8V: 20Mbps (50ns), VCCA 3.3V: 100Mbps (10ns) Digikey: 296-21527-1-ND
U$3 = tonu:TPS54332
X2 = SparkFun:USB: USB Connectors USB-B-PTH is fully proven SKU : PRT-00139 USB-miniB is fully proven SKU : PRT-00587 USB-A-PCB is untested. USB-A-H is throughly reviewed, but untested. Spark Fun Electronics SKU : PRT-00437 USB-B-SMT is throughly reviewed, but untested. Needs silkscreen touching up. USB-A-S has not been used/tested USB-MB-H has not been used/tested
Y1 = SmartPrj:RESONATOR

## Net classes
0 default: width 0.203 mm, drill 0.203 mm, clearance 0.203 mm
1 power: width 0.508 mm, drill 0.508 mm, clearance 0.203 mm
2 morepower: width 1.016 mm, drill 0.508 mm, clearance 0.203 mm
3 gnd: width 0.305 mm, drill 0.305 mm, clearance 0.203 mm